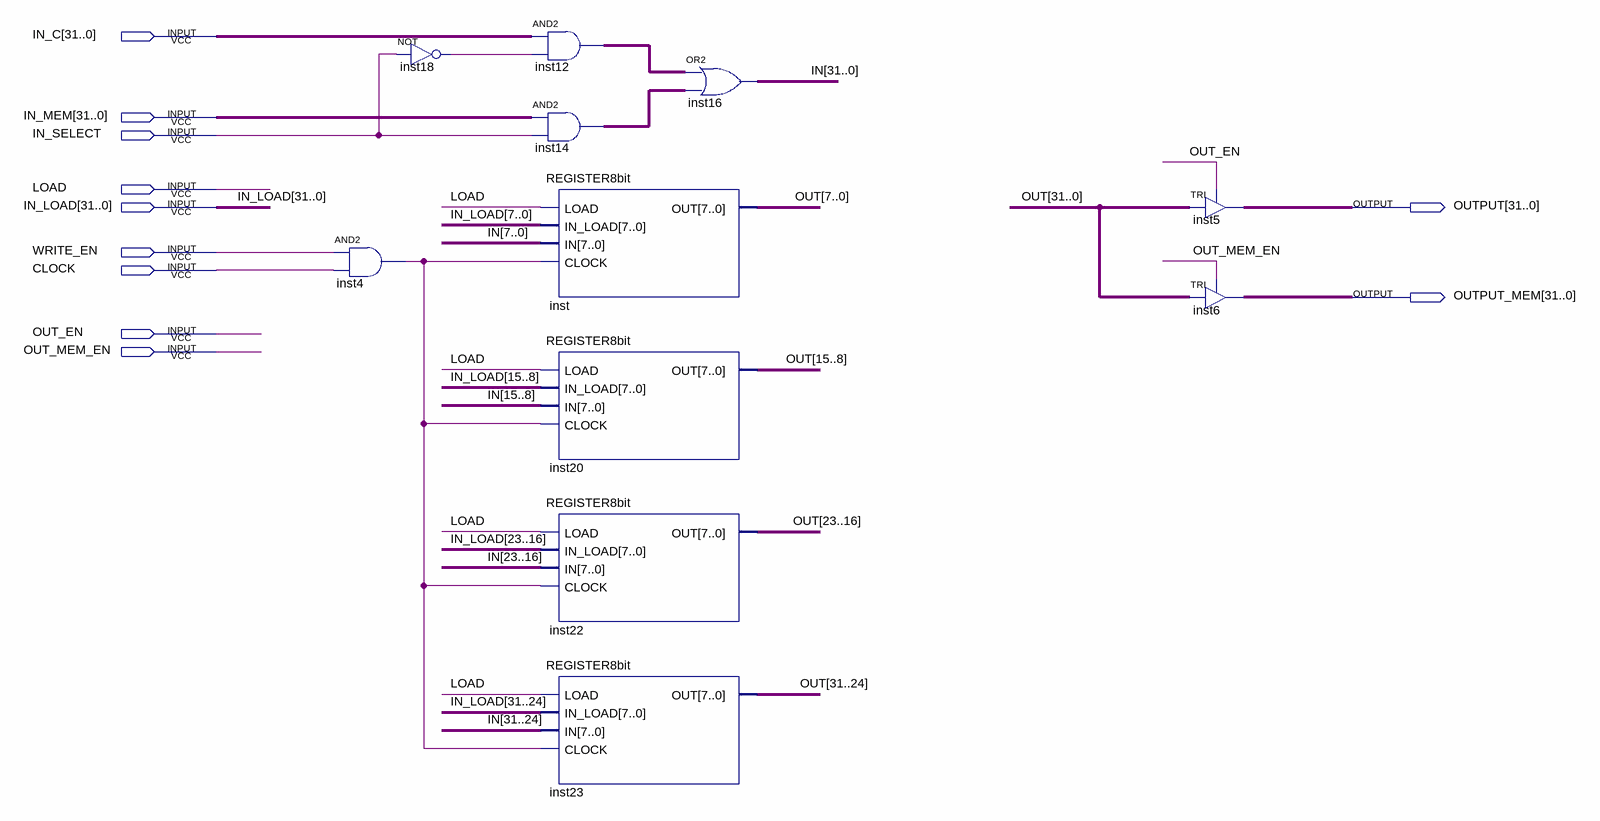
[diagram p0: schematic sheet]
// Quartus schematic REGISTER32bit.bdf as structural Verilog: 11 symbols, 11 pins
module REGISTER32bit (
  input  [31:0] IN_C,
  input  [31:0] IN_MEM,
  input  IN_SELECT,
  input  LOAD,
  input  [31:0] IN_LOAD,
  input  WRITE_EN,
  input  CLOCK,
  input  OUT_EN,
  input  OUT_MEM_EN,
  output [31:0] OUTPUT,
  output [31:0] OUTPUT_MEM
);

  wire inst4_out, inst18_out;
  wire [31:0] IN, inst12_out, inst14_out, OUT;

  and inst4 (inst4_out, WRITE_EN, CLOCK);
  not inst18 (inst18_out, IN_SELECT);
  assign inst12_out = IN_C & {32{inst18_out}};  // AND2 inst12, 32 bits wide
  assign inst14_out = IN_MEM & {32{IN_SELECT}};  // AND2 inst14, 32 bits wide
  REGISTER8bit inst (.LOAD(LOAD), .IN_LOAD(IN_LOAD[7:0]), .IN(IN[7:0]), .CLOCK(inst4_out), .OUT(OUT[7:0]));
  REGISTER8bit inst20 (.LOAD(LOAD), .IN_LOAD(IN_LOAD[15:8]), .IN(IN[15:8]), .CLOCK(inst4_out), .OUT(OUT[15:8]));
  REGISTER8bit inst22 (.LOAD(LOAD), .IN_LOAD(IN_LOAD[23:16]), .IN(IN[23:16]), .CLOCK(inst4_out), .OUT(OUT[23:16]));
  REGISTER8bit inst23 (.LOAD(LOAD), .IN_LOAD(IN_LOAD[31:24]), .IN(IN[31:24]), .CLOCK(inst4_out), .OUT(OUT[31:24]));
  assign IN = inst12_out | inst14_out;  // OR2 inst16, 32 bits wide
  TRI inst5[31:0] (.IN(OUT), .OE(OUT_EN), .OUT(OUTPUT));
  TRI inst6[31:0] (.IN(OUT), .OE(OUT_MEM_EN), .OUT(OUTPUT_MEM));
endmodule
